# EAGLE schematic MusicBox-BOTTOM (EAGLE 9.6.1)
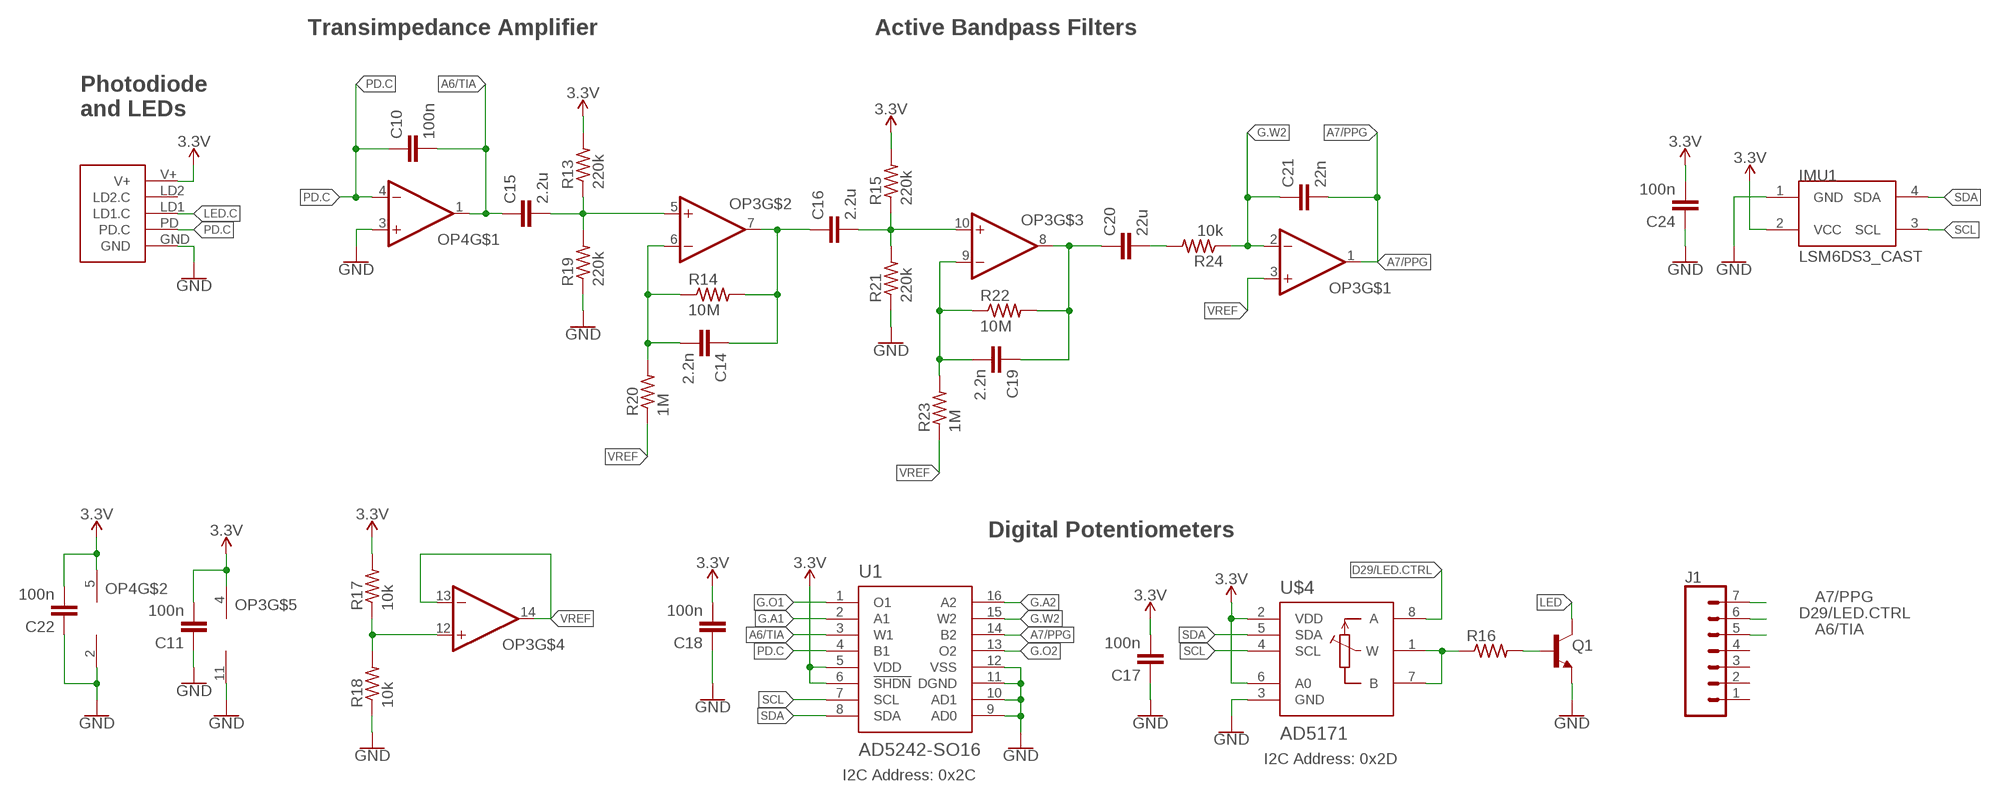
[diagram p0: schematic, sheet 1]

## Parts
C10  100n  CAPACITOR0603  [C0603]
C11  100n  CAPACITOR0603  [C0603]
C14  2.2n  CAPACITOR0603  [C0603]
C15  2.2u  CAPACITOR0603  [C0603]
C16  2.2u  CAPACITOR0603  [C0603]
C17  100n  CAPACITOR0603  [C0603]
C18  100n  CAPACITOR0603  [C0603]
C19  2.2n  CAPACITOR0603  [C0603]
C20  22u  CAPACITOR0603  [C0603]
C21  22n  CAPACITOR0603  [C0603]
C22  100n  CAPACITOR0603  [C0603]
C24  100n  CAPACITOR0603  [C0603]
IMU1  LSM6DS3_CAST  [LSM6DS3_CAST]
J1  CONN_07  [1X07]
OP3  OP-QUAD-SO14  [SO14]
OP4  OP-SINGLEOT  [SOT23-5]
Q1  NPN-GENERIC  [SOT23-3]
R13  220k  RESISTOR0603  [R0603]
R14  10M  RESISTOR0603  [R0603]
R15  220k  RESISTOR0603  [R0603]
R16  RESISTOR0603  [R0603]
R17  10k  RESISTOR0402  [R0402]
R18  10k  RESISTOR0402  [R0402]
R19  220k  RESISTOR0603  [R0603]
R20  1M  RESISTOR0603  [R0603]
R21  220k  RESISTOR0603  [R0603]
R22  10M  RESISTOR0603  [R0603]
R23  1M  RESISTOR0603  [R0603]
R24  10k  RESISTOR0603  [R0603]
U1  AD5242-SO16  [SO16]
U$3  PPG.MODULE.2  [PPG.MODULE.2]
U$4  AD5171  [SOT-23-8]

## Nets
3.3V: C11.2 C17.2 C18.2 C22.2 C24.2 IMU1.2(VCC) OP3.4(V+) OP4.5(V+) R13.2 R15.2 R17.2 U1.5(VDD) U1.6(!SHDN) U$3.V+ U$4.2(VDD) U$4.6(A0)
A6/TIA: C10.2 C15.1 J1.5 OP4.1(OUT) U1.3(W1)
A7/PPG: C21.2 J1.7 OP3.1(OUT) U1.14(B2)
D29/LED.CTRL: J1.6 U$4.8(A)
G.A1: U1.2(A1)
G.A2: U1.16(A2)
G.O1: U1.1(O1)
G.O2: U1.13(O2)
G.W2: C21.1 OP3.2(-IN) R24.1 U1.15(W2)
GND: C11.1 C17.1 C18.1 C22.1 C24.1 IMU1.1(GND) OP3.11(V-) OP4.2(V-) OP4.3(+IN) Q1.2(E) R18.1 R19.1 R21.1 U1.9(AD0) U1.10(AD1) U1.11(DGND) U1.12(VSS) U$3.GND U$4.3(GND)
LED: Q1.3(C)
LED.C: U$3.LD1(LD1.C)
N$8: Q1.1(B) R16.2
N$9: R16.1 U$4.1(W) U$4.7(B)
N$10: OP3.12(+IN) R17.1 R18.2
N$13: C15.2 OP3.5(+IN) R13.1 R19.2
N$15: C14.2 OP3.6(-IN) R14.1 R20.2
N$16: C14.1 C16.1 OP3.7(OUT) R14.2
N$17: C16.2 OP3.10(+IN) R15.1 R21.2
N$18: C19.2 OP3.9(-IN) R22.1 R23.2
N$19: C19.1 C20.1 OP3.8(OUT) R22.2
N$20: C20.2 R24.2
PD.C: C10.1 OP4.4(-IN) U1.4(B1) U$3.PD(PD.C)
SCL: IMU1.3(SCL) U1.7(SCL) U$4.4(SCL)
SDA: IMU1.4(SDA) U1.8(SDA) U$4.5(SDA)
VREF: OP3.3(+IN) OP3.13(-IN) OP3.14(OUT) R20.1 R23.1
Unconnected: J1.1 J1.2 J1.3 J1.4 U$3.LD2(LD2.C)

## Notes on the sheet
- Transimpedance Amplifier | Active Bandpass Filters
- Photodiode
  and LEDs
- Digital Potentiometers
- I2C Address: 0x2D
- I2C Address: 0x2C

## Library data of the parts
C10 C11 C14-C22 C24 = LinnesLab-Passives:CAPACITOR
IMU1 = LinnesLab-Sensors:LSM6DS3_CAST
J1 = LinnesLab-Connectors:CONN_07: Multi connection point. Often used as Generic Header-pin footprint for 0.1 inch spaced/style header connections On any of the 0.1 inch spaced packages, you can populate with these: Break Away Headers - Straight <https://www.sparkfun.com/products/116> (PRT-00116) Break Away Male Headers - Right Angle <https://www.sparkfun.com/products/553> (PRT-00553) Female Headers <https://www.sparkfun.com/products/115> (PRT-00115) Break Away Headers - Machine Pin <https://www.sparkfun.com/products/117> (PRT-00117) Break Away Female Headers - Swiss Machine Pin <https://www.sparkfun.com/products/743> (PRT-00743) For SCREWTERMINALS and SPRING TERMINALS visit here: Screw Terimnals on SparkFun.com <https://www.sparkfun.com/search/results?term=Screw+Terminals> (5mm/3.5mm/2.54mm spacing) This device is also useful as a general connection point to wire up your design to another part of your project. Our various solder wires solder well into these plated through hole pads. Hook-Up Wire - Assortment (Stranded, 22 AWG) <https://www.sparkfun.com/products/11375> (PRT-11375) Hook-Up Wire - Assortment (Solid Core, 22 AWG) <https://www.sparkfun.com/products/11367> (PRT-11367) View the entire wire category on our website here <https://www.sparkfun.com/categories/141> Special notes: Molex polarized connector foot print use with SKU : PRT-08231 with associated crimp pins and housings. 1MM SMD Version SKU: PRT-10208 NOTES ON THE VARIANTS LOCK and LOCK_LONGPADS... This footprint was designed to help hold the alignment of a through-hole component (i.e. 6-pin header) while soldering it into place. You may notice that each hole has been shifted either up or down by 0.005 of an inch from it's more standard position (which is a perfectly straight line). This slight alteration caused the pins (the squares in the middle) to touch the edges of the holes. Because they are alternating, it causes a "brace" to hold the component in place. 0.005 has proven to be the perfect amount of "off-center" position when using our standard breakaway headers. Although looks a little odd when you look at the bare footprint, once you have a header in there, the alteration is very hard to notice. Also,if you push a header all the way into place, it is covered up entirely on the bottom side.
OP3 = LinnesLab-AnalogIC:OP-QUAD: General symbol and footprints for Quad Op Amps. Use with any standard general purpose op amp.
OP4 = LinnesLab-AnalogIC:OP-SINGLE: Single Op Amp 2.7V to 6.0V Single Supply CMOS Source: http://ww1.microchip.com/downloads/en/DeviceDoc/21314g.pdf
Q1 = LinnesLab-DiscreteSemi:NPN
R13-R24 = LinnesLab-Passives:RESISTOR
U1 = LinnesLab-DigitalIC:AD5242
U$3 = LinnesLab-Connectors:PPG.MODULE.2: Digi-Key Part Number: S9014E-50-ND Manufacturer Part Number: GRPB501VWVN-RC Description: 1mm insulation height 0.05in pitch 50 positions
U$4 = LinnesLab-DigitalIC:AD5171